# EAGLE design core-debug (EAGLE 6.4)
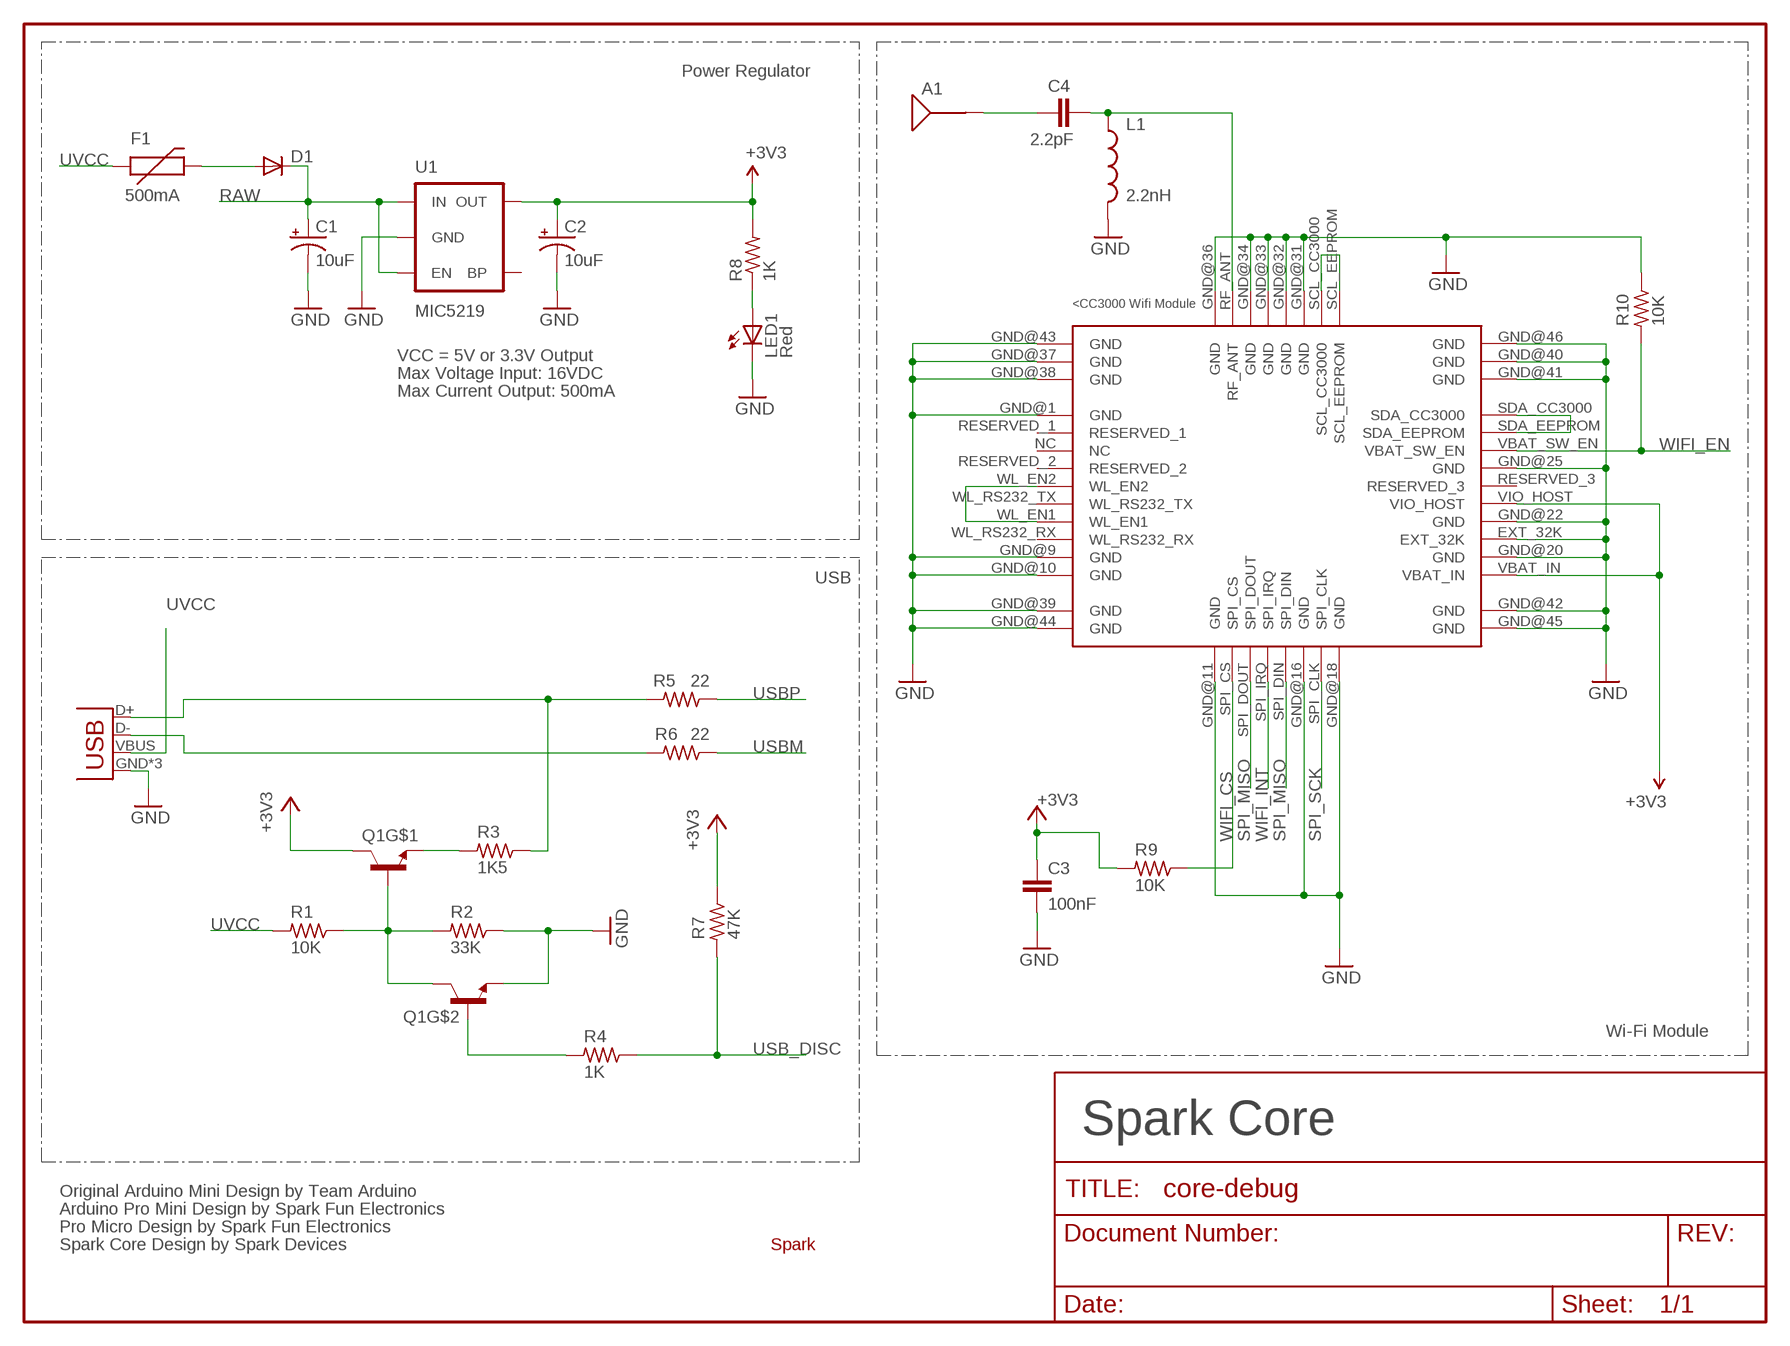
[diagram p0: schematic, sheet 1, part 1 of 2]
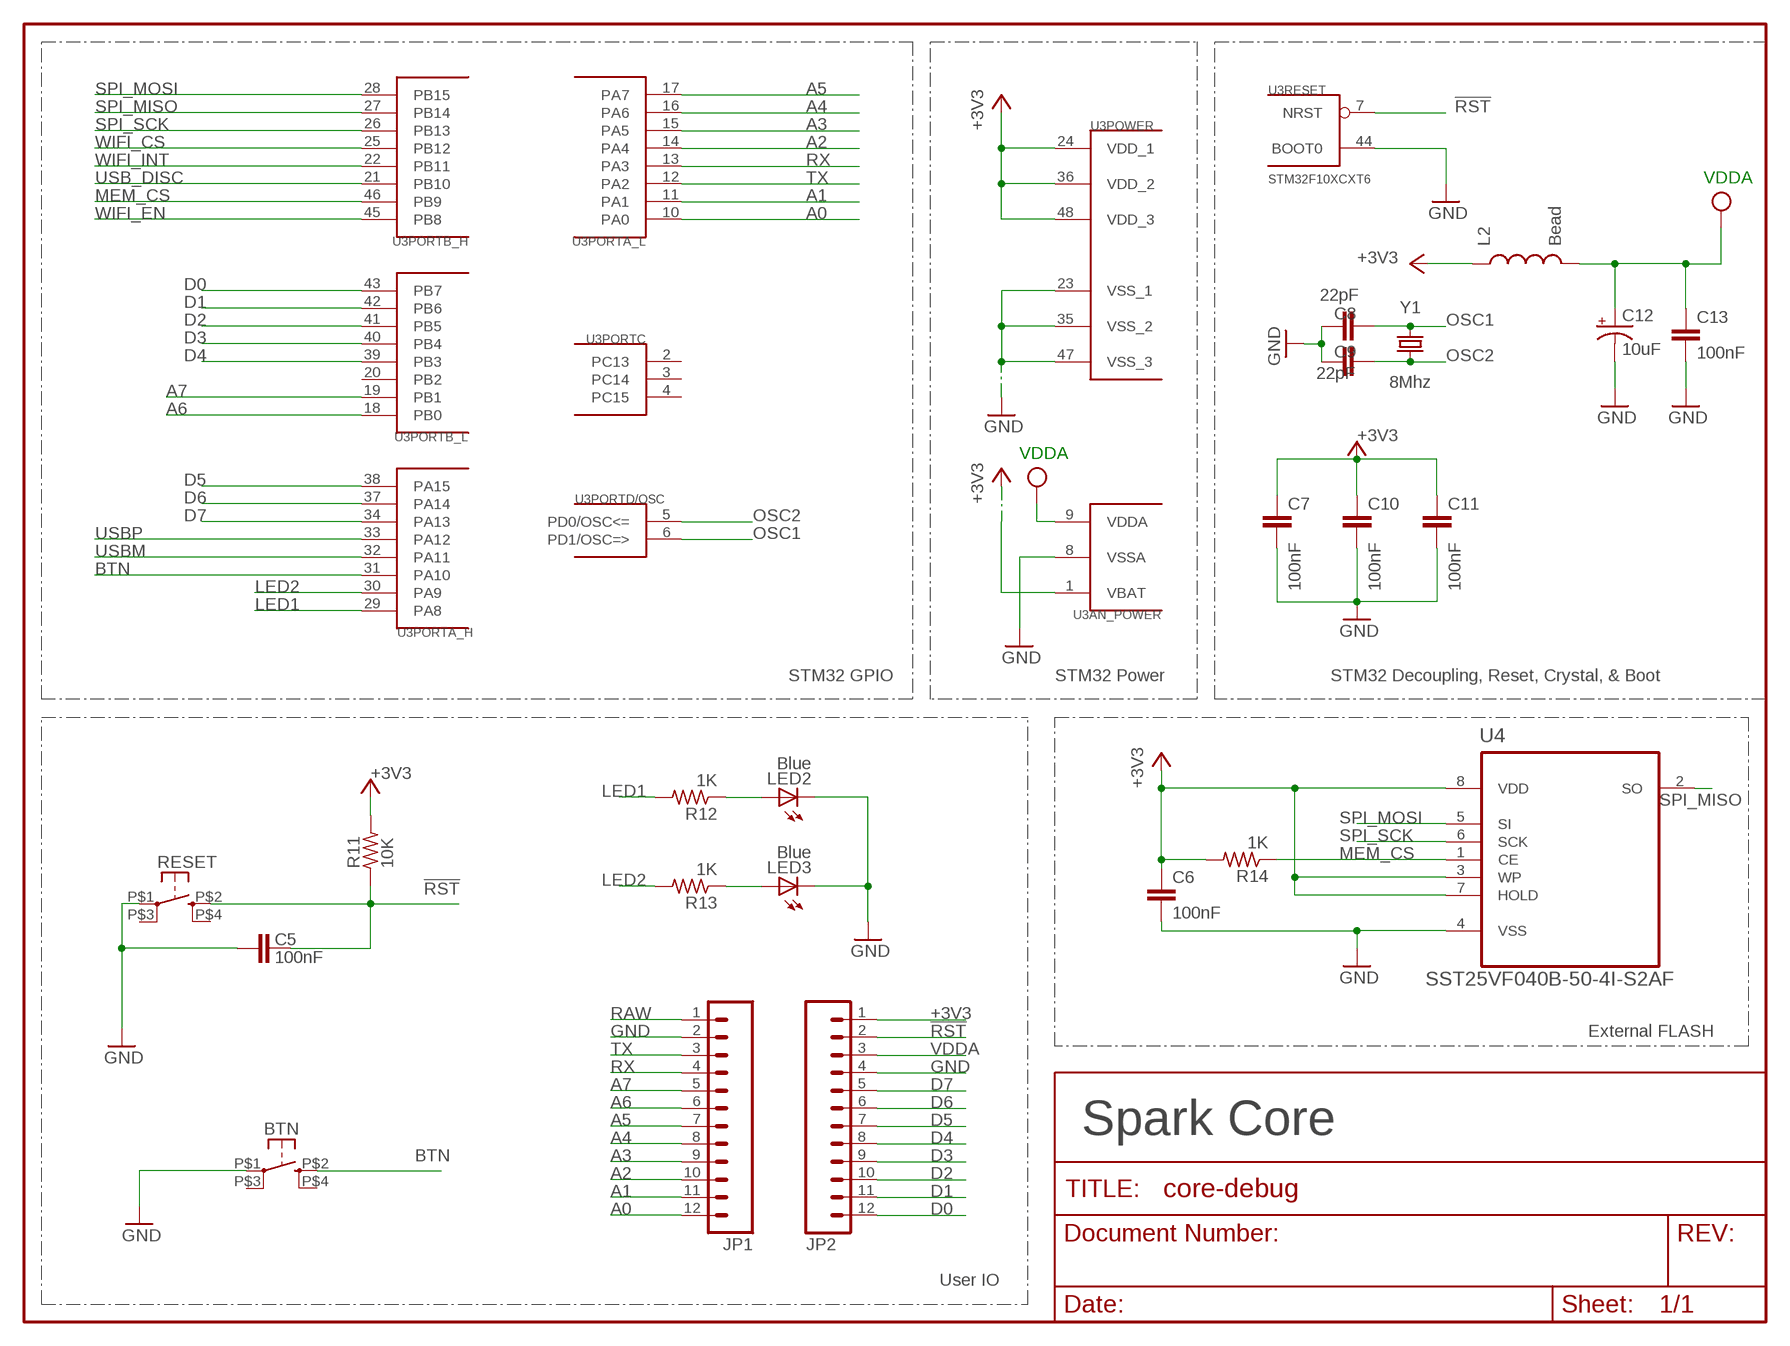
[diagram p1: schematic, sheet 1, part 2 of 2]

## Parts
A1  ANTENNA2SMD5  [ANTENNA-CHIP5]
BTN  KMR211GLFS  BUTTON-KMR241GLFS  [PUSHBUTTON-KMR241GLFS]
C1  10uF  CAP_POL1206  [EIA3216]
C2  10uF  CAP_POL1206  [EIA3216]
C3  100nF  C-EUC0603  [C0603]
C4  2.2pF  C-EUC0603  [C0603]
C5  100nF  C-EUC0603  [C0603]
C6  100nF  C-EUC0603  [C0603]
C7  100nF  C-EUC0603  [C0603]
C8  22pF  C-EUC0603  [C0603]
C9  22pF  C-EUC0603  [C0603]
C10  100nF  C-EUC0603  [C0603]
C11  100nF  C-EUC0603  [C0603]
C12  10uF  CAP_POL1206  [EIA3216]
C13  100nF  C-EUC0603  [C0603]
D1  DIODESOD  [SOD-323]
F1  500mA  PTCSMD  [PTC-1206]
JP1  M12PTH  [1X12]
JP2  M12PTH  [1X12]
L1  2.2nH  INDUCTOR0603  [0603]
L2  Bead  INDUCTOR0603  [0603]
LED1  Red  LED0603  [LED-0603]
LED2  Blue  LED0603  [LED-0603]
LED3  Blue  LED0603  [LED-0603]
Q1  MMDT3904  [SOT363]
R1  10K  R-US_R0603  [R0603]
R2  33K  R-US_R0603  [R0603]
R3  1K5  R-US_R0603  [R0603]
R4  1K  R-US_R0603  [R0603]
R5  22  R-US_R0603  [R0603]
R6  22  R-US_R0603  [R0603]
R7  47K  R-US_R0603  [R0603]
R8  1K  R-US_R0603  [R0603]
R9  10K  R-US_R0603  [R0603]
R10  10K  R-US_R0603  [R0603]
R11  10K  R-US_R0603  [R0603]
R12  1K  R-US_R0603  [R0603]
R13  1K  R-US_R0603  [R0603]
R14  1K  R-US_R0603  [R0603]
RESET  KMR211GLFS  BUTTON-KMR241GLFS  [PUSHBUTTON-KMR241GLFS]
U1  MIC5219  V_REG_LDOSMD  [SOT23-5]
U2  CC3000  [CC3000]
U3  STM32F10XCXT6  [TQFP48]
U4  SST25VF040B-50-4I-S2AF  [SOIC127P790X216-8N]
U$1  SPARK_LOGO2  [SPARK_LOGO2]
X1  USB-MICROB  [USB-MICROB]
Y1  8Mhz  CRYSTAL5X3  [CRYSTAL-SMD-5X3]

## Nets
!RST: C5.2 JP2.2 R11.1 RESET.P$2 U3.7(RESET:NRST)
+3V3: C2.A(+) C3.1 C6.1 C7.1 C10.1 C11.1 JP2.1 L2.1 Q1.3(C) R7.1 R8.2 R9.2 R11.2 R14.2 U1.5(OUT) U2.VBAT_IN U2.VIO_HOST U3.1(AN_POWER:VBAT) U3.24(POWER:VDD_1) U3.36(POWER:VDD_2) U3.48(POWER:VDD_3) U4.3(WP) U4.7(HOLD) U4.8(VDD)
A0: JP1.12 U3.10(PORTA_L:PA0)
A1: JP1.11 U3.11(PORTA_L:PA1)
A2: JP1.10 U3.14(PORTA_L:PA4)
A3: JP1.9 U3.15(PORTA_L:PA5)
A4: JP1.8 U3.16(PORTA_L:PA6)
A5: JP1.7 U3.17(PORTA_L:PA7)
A6: JP1.6 U3.18(PORTB_L:PB0)
A7: JP1.5 U3.19(PORTB_L:PB1)
BTN: BTN.P$2 U3.31(PORTA_H:PA10)
D0: JP2.12 U3.43(PORTB_L:PB7)
D1: JP2.11 U3.42(PORTB_L:PB6)
D2: JP2.10 U3.41(PORTB_L:PB5)
D3: JP2.9 U3.40(PORTB_L:PB4)
D4: JP2.8 U3.39(PORTB_L:PB3)
D5: JP2.7 U3.38(PORTA_H:PA15)
D6: JP2.6 U3.37(PORTA_H:PA14)
D7: JP2.5 U3.34(PORTA_H:PA13)
GND [vcc]: BTN.P$1 C1.C(-) C2.C(-) C3.2 C5.1 C6.2 C7.2 C8.2 C9.2 C10.2 C11.2 C12.C(-) C13.2 JP1.2 JP2.4 L1.2 LED1.C LED2.C LED3.C Q1.1(E) R2.1 R10.1 RESET.P$1 U1.2(GND) U2.EXT_32K U2.GND@1(GND) U2.GND@9(GND) U2.GND@10(GND) U2.GND@11(GND) U2.GND@16(GND) U2.GND@18(GND) U2.GND@20(GND) U2.GND@22(GND) U2.GND@25(GND) U2.GND@31(GND) U2.GND@32(GND) U2.GND@33(GND) U2.GND@34(GND) U2.GND@36(GND) U2.GND@37(GND) U2.GND@38(GND) U2.GND@39(GND) U2.GND@40(GND) U2.GND@41(GND) U2.GND@42(GND) U2.GND@43(GND) U2.GND@44(GND) U2.GND@45(GND) U2.GND@46(GND) U3.8(AN_POWER:VSSA) U3.23(POWER:VSS_1) U3.35(POWER:VSS_2) U3.44(RESET:BOOT0) U3.47(POWER:VSS_3) U4.4(VSS) X1.GND X1.MT1(GND) X1.MT2(GND)
LED1: R12.2 U3.29(PORTA_H:PA8)
LED2: R13.2 U3.30(PORTA_H:PA9)
MEM_CS: R14.1 U3.46(PORTB_H:PB9) U4.1(CE)
N$1: R3.1 R5.2 X1.D+
N$2: LED2.A R12.1
N$3: D1.2(A) F1.2
N$4: C4.2 L1.1 U2.RF_ANT
N$5: A1.FEED(SIGNAL) C4.1
N$6: R6.2 X1.D-
N$7: U2.SCL_CC3000 U2.SCL_EEPROM
N$8: Q1.2(B) R4.2
N$9: U2.WL_EN1 U2.WL_EN2
N$10: LED3.A R13.1
N$13: Q1.5(B) Q1.6(C) R1.1 R2.2
N$15: U2.SDA_CC3000 U2.SDA_EEPROM
N$16: Q1.4(E) R3.2
N$38: LED1.A R8.1
OSC1: C8.1 U3.6(PORTD/OSC:PD1/OSC=>) Y1.3
OSC2: C9.1 U3.5(PORTD/OSC:PD0/OSC<=) Y1.1
RAW [vcc]: C1.A(+) D1.1(C) JP1.1 U1.1(IN) U1.3(EN)
RX: JP1.4 U3.13(PORTA_L:PA3)
SPI_MISO: U2.SPI_DIN U2.SPI_DOUT U3.27(PORTB_H:PB14) U4.2(SO)
SPI_MOSI: U3.28(PORTB_H:PB15) U4.5(SI)
SPI_SCK: U2.SPI_CLK U3.26(PORTB_H:PB13) U4.6(SCK)
TX: JP1.3 U3.12(PORTA_L:PA2)
USB_DISC: R4.1 R7.2 U3.21(PORTB_H:PB10)
USBM: R6.1 U3.32(PORTA_H:PA11)
USBP: R5.1 U3.33(PORTA_H:PA12)
UVCC: F1.1 R1.2 X1.VBUS
VDDA: C12.A(+) C13.1 JP2.3 L2.2 U3.9(AN_POWER:VDDA) ; supply symbol labelled VCC
WIFI_CS: R9.1 U2.SPI_CS U3.25(PORTB_H:PB12)
WIFI_EN: R10.2 U2.VBAT_SW_EN U3.45(PORTB_H:PB8)
WIFI_INT: U2.SPI_IRQ U3.22(PORTB_H:PB11)
Unconnected: BTN.P$3 BTN.P$4 RESET.P$3 RESET.P$4 U1.4(BP) U2.NC U2.RESERVED_1 U2.RESERVED_2 U2.RESERVED_3 U2.WL_RS232_RX U2.WL_RS232_TX U3.2(PORTC:PC13) U3.3(PORTC:PC14) U3.4(PORTC:PC15) U3.20(PORTB_L:PB2)

## Notes on the sheet
- Power Regulator
- VDDA
- VCC = 5V or 3.3V Output
- Max Voltage Input: 16VDC
- Max Current Output: 500mA
- VDDA
- USB
- STM32 GPIO | STM32 Power | STM32 Decoupling, Reset, Crystal, & Boot
- Wi-Fi Module | External FLASH
- Spark Core | Spark Core
- Original Arduino Mini Design by Team Arduino
- Arduino Pro Mini Design by Spark Fun Electronics
- Pro Micro Design by Spark Fun Electronics
- Spark Core Design by Spark Devices
- User IO

## Library data of the parts
A1 = SparkFun-RF:ANTENNA2: Chip antenna Single endded antenna. Common with smaller chip antennas. CHIP4 package is the GPS Chip Antenna SKU: GPS-08418. CHIP5 package is 2.4GHz chip antenna SKU: WRL-00144.
BTN RESET = okie:BUTTON-KMR241GLFS
C1 C2 C12 = SparkFun:CAP_POL: Capacitor Polarized These are standard SMD and PTH capacitors. Normally 10uF, 47uF, and 100uF in electrolytic and tantalum varieties. Always verify the external diameter of the through hole cap, it varies with capacity, voltage, and manufacturer. The EIA devices should be standard.
C3-C11 C13 = rcl:C-EU: CAPACITOR, European symbol
D1 = SparkFun:DIODE: Diode These are standard reverse protection diodes and small signal diodes. SMA package can handle up to about 1A. SOD-323 can handle about 200mA. What the SOD-323 package when ordering, there are some mfgs out there that are 5-pin packages.
F1 = SparkFun:PTC: Resettable Fuse PTC Resettable Fuse. Spark Fun Electronics SKU : COM-08357
JP1 JP2 = SparkFun:M12: Header 12 Standard 12-pin 0.1" header. Use with straight break away headers (SKU : PRT-00116), right angle break away headers (PRT-00553), swiss pins (PRT-00743), machine pins (PRT-00117), and female headers (PRT-00115).
L1 L2 = SparkFun-Passives:INDUCTOR: Inductors Basic Inductor/Choke - 0603 and 1206. Footprints are not proven and vary greatly between part numbers.
LED1-LED3 = SparkFun:LED: LEDs Standard schematic elements and footprints for 5mm, 3mm, 1206, and 0603 sized LEDs. 5mm - Spark Fun Electronics SKU : COM-00529 (and others)
Q1 = SparkFun-DiscreteSemi:MMDT3904: Dual NPN transistor
R1-R14 = rcl:R-US_: RESISTOR, American symbol
U1 = SparkFun:V_REG_LDO: Voltage Regulator LDO Standard 150mA LDO voltage regulator in SOT-23 layout. Micrel part MIC5205. BP (by-pass) pin is used to lower output noise with 470pF cap.
U2 = CC3000:CC3000
U3 = stm32:STM32F10XCXT6: ST STM32F101/103 48pin LQFP
U4 = Silicon_Storage_Tech_By_element14_Batch_1:SST25VF040B-50-4I-S2AF: 4 Mbit SPI Serial Flash; MPN: SST25VF040B-50-4I-S2AF; OC_FARNELL: 1368690; OC_NEWARK: -; PACKAGE: SOIC-8; SUPPLIER: SILICON STORAGE TECHNOLOGY
U$1 = Spark:SPARK_LOGO2
X1 = SparkFun-Connectors:USB: USB Connectors USB-B-PTH is fully proven SKU : PRT-00139/CONN-08278 USB-miniB is fully proven SKU : PRT-00587 USB-A-PCB is untested. USB-A-H is throughly reviewed, but untested. Spark Fun Electronics SKU : PRT-00437 USB-B-SMT is throughly reviewed, but untested. Needs silkscreen touching up. USB-A-S has not been used/tested USB-MB-H has not been used/tested USB-MICROB has been used. CONN-09505; PROD_ID: CONN-09505
Y1 = SparkFun:CRYSTAL: Crystals Various standard crystals. Proven footprints. Spark Fun Electronics SKU : COM-00534

## Board
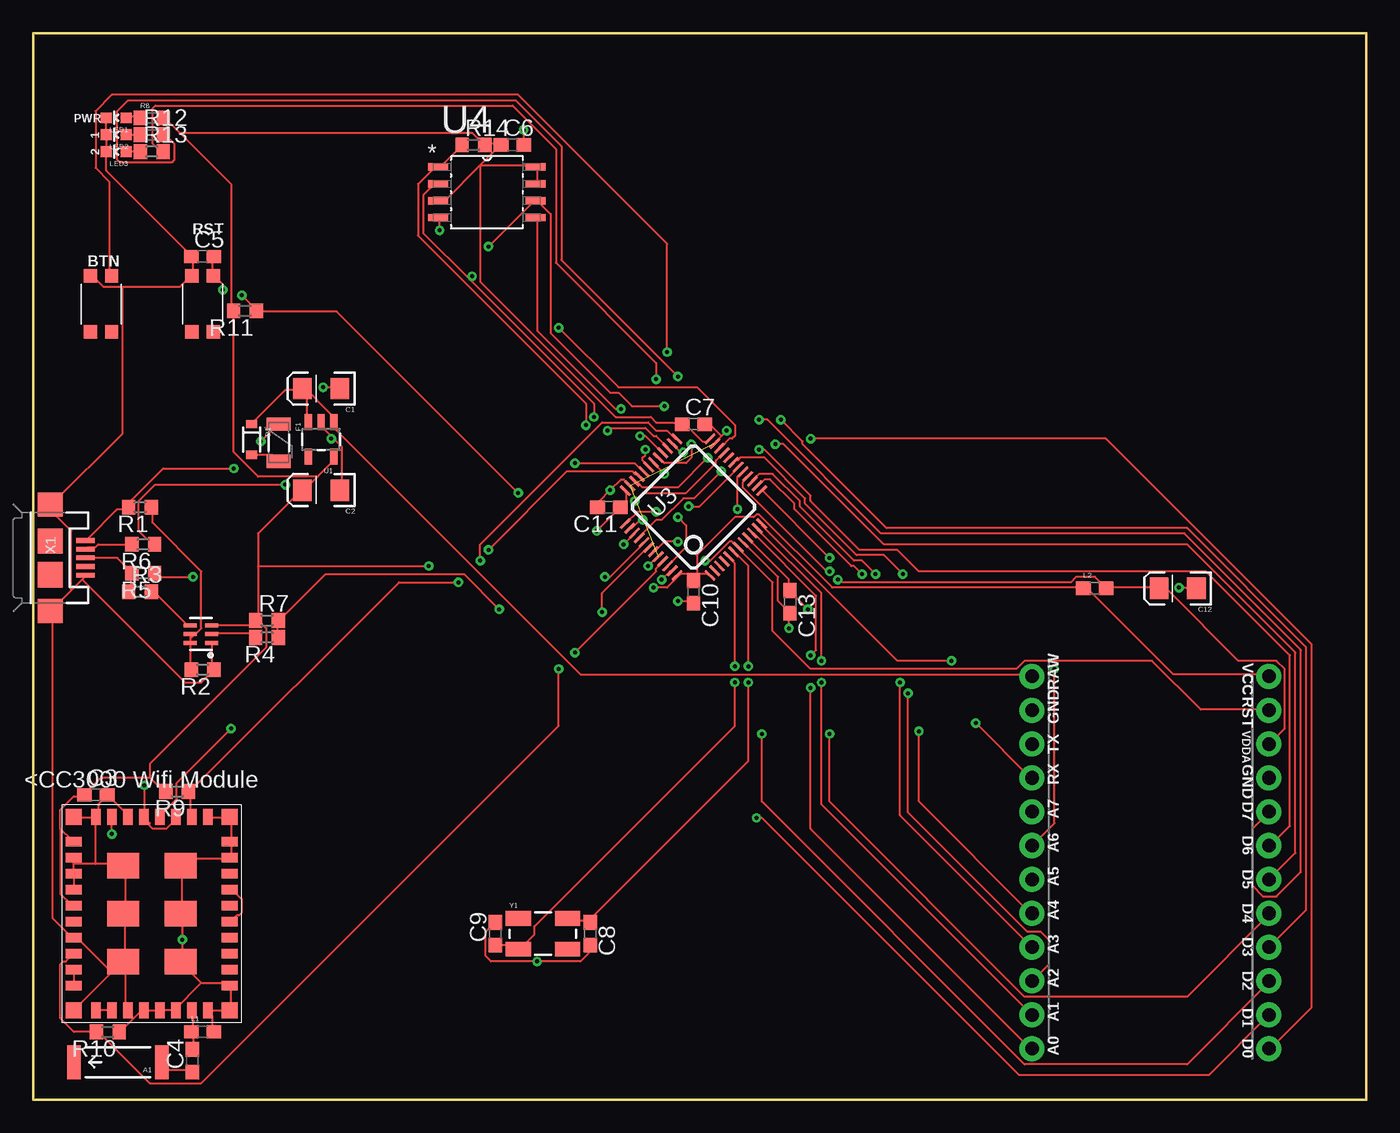
[diagram p2: board, top side]
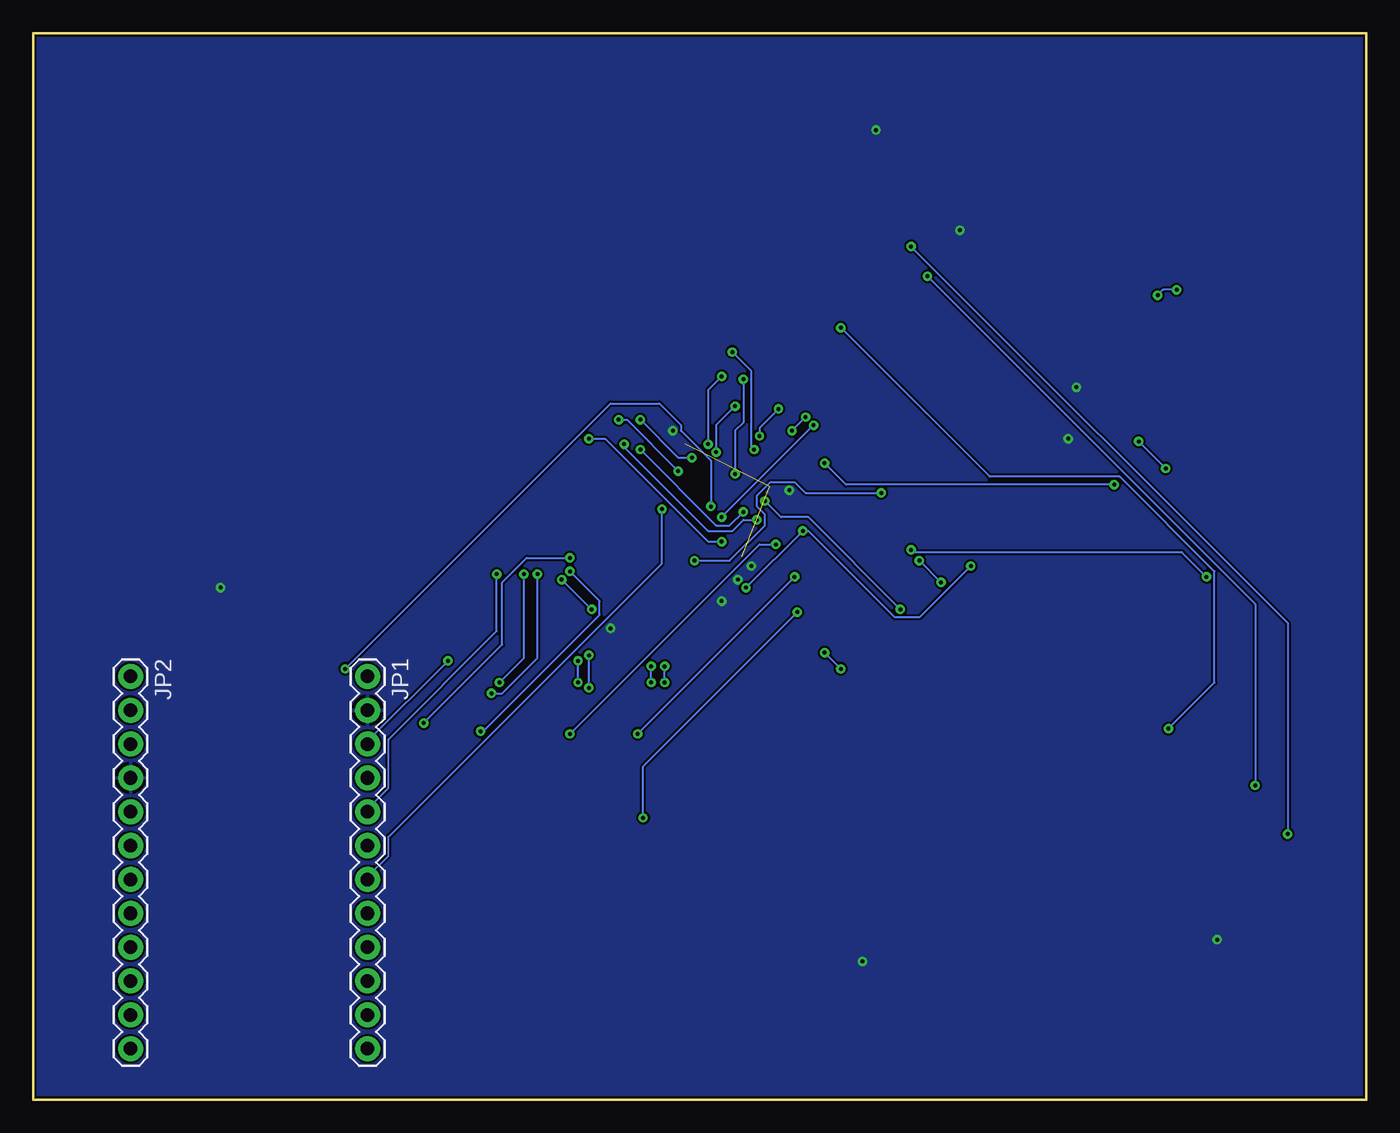
[diagram p3: board, bottom side, seen from below]

Size 100 x 80 mm. Coordinates in mm from the lower left corner, seen from the top.
Outline: 0,80 0,0 100,0 100,80 0,80
Copper layers (1*16): Top 0.035mm / dielectric 1.5mm / Bottom 0.035mm
Design rules "default *": minimum track width 6mil, minimum drill 0.3mm, track to track 6mil, track to pad 6mil, pad to pad 6mil, via to via 6mil, smd to smd 6mil, copper to edge 6mil, drill to drill 6mil, minimum pad ring 12mil, minimum via ring 8mil, stop-mask expansion 4mil, vias tented up to drill 20mil, thermal gap 10mil

### Footprints (pad centres in the part's own frame; a part is rotated, then mirrored left to right if it is on the bottom)
ANTENNA-CHIP5 = smd 1.016 x 2.54: FEED -3.302,0; NC 3.302,0
PUSHBUTTON-KMR241GLFS = smd 1 x 1: P$1 2.1,0.8; P$2 2.1,-0.8; P$3 -2.1,0.8; P$4 -2.1,-0.8
EIA3216 = smd 1.4 x 1.6: A 1.4,0; C -1.4,0
C0603 = smd 1.1 x 1: 1 -0.85,0; 2 0.85,0
SOD-323 = smd 0.63 x 0.83: 1 -1.15,0; 2 1.15,0
PTC-1206 = smd 1 x 1.8: 1 -1.4,0; 2 1.4,0
1X12 = drill 1.016 pad 1.88: 1 0,0; 2 2.54,0; 3 5.08,0; 4 7.62,0; 5 10.16,0; 6 12.7,0; 7 15.24,0; 8 17.78,0; 9 20.32,0; 10 22.86,0; 11 25.4,0; 12 27.94,0
0603 = smd 1.1 x 1: 1 -0.85,0; 2 0.85,0
LED-0603 = smd 0.8 x 0.8: A 0,-0.75; C 0,0.75
SOT363 = smd 0.3 x 0.99: 1 -0.65,-0.8; 2 0,-0.8; 3 0.65,-0.8; 4 0.65,0.81; 5 0,0.81; 6 -0.65,0.81
R0603 = smd 1 x 1.1: 1 -0.85,0; 2 0.85,0
SOT23-5 = smd 0.55 x 1.2: 1 -0.95,-1.3; 2 0,-1.3; 3 0.95,-1.3; 4 0.95,1.3; 5 -0.95,1.3
CC3000 = smd 1.2 x 0.7: EXT_32K 5.85,-2.97; GND@1 -5.85,5.43; GND@9 -5.85,-4.17; GND@10 -5.85,-5.37; GND@20 5.85,-4.17; GND@22 5.85,-1.77; GND@25 5.85,1.83; NC -5.85,3.03; RESERVED_1 -5.85,4.23; RESERVED_2 -5.85,1.83; RESERVED_3 5.85,0.63; SDA_CC3000 5.85,5.43; SDA_EEPROM 5.85,4.23; VBAT_IN 5.85,-5.37; VBAT_SW_EN 5.85,3.03; VIO_HOST 5.85,-0.57; WL_EN1 -5.85,-1.77; WL_EN2 -5.85,0.63; WL_RS232_RX -5.85,-2.97; WL_RS232_TX -5.85,-0.57 | smd 0.7 x 1.2: GND@11 -4.2,-7.22; GND@16 1.8,-7.22; GND@18 4.2,-7.22; GND@31 1.8,7.28; GND@32 0.6,7.28; GND@33 -0.6,7.28; GND@34 -1.8,7.28; GND@36 -4.2,7.28; RF_ANT -3,7.28; SCL_CC3000 3,7.28; SCL_EEPROM 4.2,7.28; SPI_CLK 3,-7.22; SPI_CS -3,-7.22; SPI_DIN 0.6,-7.22; SPI_DOUT -1.8,-7.22; SPI_IRQ -0.6,-7.22 | smd 2.4 x 1.9: GND@37 -2.15,3.63; GND@38 -2.15,0.03; GND@39 -2.15,-3.57; GND@40 2.15,3.63; GND@41 2.15,0.03; GND@42 2.15,-3.57 | smd 1.2 x 1.2: GND@43 -5.85,7.28; GND@44 -5.85,-7.22; GND@45 5.85,-7.22; GND@46 5.85,7.28
TQFP48 = smd 0.2 x 1: 1 -2.75,-4.5; 2 -2.25,-4.5; 3 -1.75,-4.5; 4 -1.25,-4.5; 5 -0.75,-4.5; 6 -0.25,-4.5; 7 0.25,-4.5; 8 0.75,-4.5; 9 1.25,-4.5; 10 1.75,-4.5; 11 2.25,-4.5; 12 2.75,-4.5; 25 2.75,4.5; 26 2.25,4.5; 27 1.75,4.5; 28 1.25,4.5; 29 0.75,4.5; 30 0.25,4.5; 31 -0.25,4.5; 32 -0.75,4.5; 33 -1.25,4.5; 34 -1.75,4.5; 35 -2.25,4.5; 36 -2.75,4.5 | smd 1 x 0.2: 13 4.5,-2.75; 14 4.5,-2.25; 15 4.5,-1.75; 16 4.5,-1.25; 17 4.5,-0.75; 18 4.5,-0.25; 19 4.5,0.25; 20 4.5,0.75; 21 4.5,1.25; 22 4.5,1.75; 23 4.5,2.25; 24 4.5,2.75; 37 -4.5,2.75; 38 -4.5,2.25; 39 -4.5,1.75; 40 -4.5,1.25; 41 -4.5,0.75; 42 -4.5,0.25; 43 -4.5,-0.25; 44 -4.5,-0.75; 45 -4.5,-1.25; 46 -4.5,-1.75; 47 -4.5,-2.25; 48 -4.5,-2.75
SOIC127P790X216-8N = smd 1.499 x 0.559: 1 -3.658,1.905; 2 -3.658,0.635; 3 -3.658,-0.635; 4 -3.658,-1.905; 5 3.658,-1.905; 6 3.658,-0.635; 7 3.658,0.635; 8 3.658,1.905
USB-MICROB = smd 0.35 x 1.4: D+ 0,2.65; D- -0.65,2.65; GND 1.3,2.65; ID 0.65,2.65; VBUS -1.3,2.65 | smd 1.8 x 1.9: MT1 -4,0; MT2 4,0 | smd 1.9 x 1.9: P$1 -1.27,0; P$2 1.27,0
CRYSTAL-SMD-5X3 = smd 1.9 x 1.1: 1 -1.85,-1.15; 2 1.85,-1.15; 3 1.85,1.15; 4 -1.85,1.15

### Placement (x,y rotation side)
A1  6.35,2.79 180 top
BTN  5.08,59.69 90 top
C1  21.59,53.34 180 top
C2  21.59,45.72 180 top
C3  4.7,22.86 0 top
C4  11.94,2.92 90 top
C5  12.7,63.25 0 top
C6  35.94,71.63 0 top
C7  49.53,50.67 0 top
C8  41.78,12.45 270 top
C9  34.67,12.45 90 top
C10  49.53,38.1 270 top
C11  43.18,44.45 180 top
C12  85.85,38.35 180 top
C13  56.77,37.34 270 top
D1  16.38,49.53 270 top
F1  18.41,49.28 270 top
JP1  74.93,31.75 270 bottom
JP2  92.71,31.75 270 bottom
L1  12.7,5.08 0 top
L2  79.63,38.35 0 top
LED1  6.22,73.66 90 top
LED2  6.22,72.39 90 top
LED3  6.22,71.12 90 top
Q1  12.57,34.92 90 top
R1  8,44.45 180 top
R2  12.7,32.26 180 top
R3  8,38.1 0 top
R4  17.53,34.67 180 top
R5  8.26,39.5 180 top
R6  8.26,41.66 180 top
R7  17.53,35.94 0 top
R8  8.89,73.66 0 top
R9  10.79,23.11 180 top
R10  5.59,5.08 180 top
R11  15.88,59.18 180 top
R12  8.89,72.39 0 top
R13  8.89,71.12 0 top
R14  33.02,71.63 0 top
RESET  12.7,59.69 90 top
U1  21.59,49.53 180 top
U2  8.89,13.97 180 top
U3  49.53,44.45 45 top
U4  34.04,68.07 0 top
U$1  91.44,33.02 0 top
X1  1.27,40.64 270 top
Y1  38.23,12.45 0 top

### Tracks (layer width: path | path; a pad name or v marks a point on that pad's centre or on a via)
!RST  (via drill 0.3)
  Top 0.152: C5.2 13.41,63.2 13.41,61.98 RESET.P$2 13.61,61.77 14.22,61.16 v14.22,60.76 | v15.65,60.35 16.66,59.33 R11.1 16.87,59.13 22.76,59.13 v36.37,45.52 | JP2.2 92.66,29.26 87.58,29.26 83.92,32.92 74.37,32.92 73.76,32.31 58.32,32.31 55.47,35.15 55.47,38.81 53.03,41.25 U3.7 52.83,41.45 52.43,41.86 52.22,41.86 50.8,40.44 v50.39,40.44
  Bottom 0.152: v15.65,60.35 15.24,60.76 v14.22,60.76 | v36.37,45.52 42.06,45.52 42.88,46.33 44.7,46.33 45.72,45.31 45.72,44.5 45.11,43.89 45.11,43.08 47.75,40.44 v50.39,40.44
+3V3  (via drill 0.3)
  Top 0.152: U3.36 44.5,45.52 44.5,44.91 44.09,44.5 C11.1 43.89,44.3 v42.27,42.67 | 49.78,39.42 50.6,39.42 U3.1 | 49.78,39.42 49.58,39.42 | 49.58,39.42 48.56,39.42 | 48.56,39.42 48.36,39.42 U3.48 | 49.58,39.42 49.58,39.01 C10.1 49.78,39.42 | v46.53,38.41 47.55,38.41 48.56,39.42 | JP2.1 92.66,31.9 85.55,31.9 79.25,38.2 78.84,38.2 L2.1 78.64,38.41 59.94,38.41 54.46,43.89 54.25,43.89 54.05,43.69 52.63,43.69 49.78,40.84 49.78,39.42 | U3.24 50.6,49.38 50.19,49.38 48.77,50.8 C7.1 48.56,50.8 46.74,50.8 46.33,51.21 43.69,51.21 33.53,61.37 33.53,70.1 | U4.7 37.8,68.89 37.8,69.9 U4.8 37.59,70.1 33.53,70.1 | 33.53,70.1 34.95,71.53 C6.1 34.95,71.73 33.93,71.73 R14.2 33.73,71.73 32.92,72.54 10.97,72.54 | 33.53,70.1 30.89,67.46 30.48,67.46 U4.3 | 10.97,72.54 9.75,73.76 R8.2 | 10.97,72.54 14.83,68.68 14.83,59.33 R11.2 15.04,59.13 15.04,48.56 16.87,46.74 21.34,46.74 | 2.03,20.32 2.03,21.74 3.05,22.76 3.66,22.76 C3.1 3.86,22.96 5.08,24.18 8.74,24.18 | 2.03,20.32 2.85,19.51 U2.VBAT_IN | 8.74,24.18 9.75,23.16 R9.2 | 2.03,20.32 2.03,15.44 2.85,14.63 U2.VIO_HOST | Q1.3 13.41,35.56 16.46,35.56 16.66,35.76 R7.1 16.87,35.97 | 21.34,46.74 20.32,45.72 C2.A 20.12,45.72 16.87,42.47 16.87,40.03 | 21.34,46.74 22.35,47.75 22.35,48.16 U1.5 | 16.87,40.03 16.87,35.97 | 8.74,24.18 8.74,25.2 17.48,33.93 17.48,35.36 16.87,35.97 | 16.87,40.03 v29.67,40.03
  Bottom 0.152: v46.53,38.41 v42.27,42.67 41.86,42.67 35.36,36.17 33.53,36.17 v29.67,40.03
A0  (via drill 0.3)
  Top 0.152: v58.32,33.33 58.73,33.73 58.73,37.8 54.05,42.47 U3.10 | v58.32,30.89 58.32,20.32 74.78,3.86 JP1.12
  Bottom 0.152: v58.32,30.89 v58.32,33.33
A1  (via drill 0.3)
  Top 0.152: v59.13,32.92 59.13,38 54.46,42.67 U3.11 | v59.13,31.29 59.13,22.15 JP1.11
  Bottom 0.152: v59.13,31.29 v59.13,32.92
A2  (via drill 0.3)
  Top 0.152: v62.18,39.42 61.57,40.03 61.37,40.03 57.1,44.3 57.1,44.7 55.27,46.53 54.86,46.53 54.46,46.13 U3.14 | v65.63,30.48 65.63,21.54 74.57,12.6 75.59,12.6 76.2,11.99 76.2,10.16 JP1.10
  Bottom 0.152: v62.18,39.42 62.18,33.12 64.82,30.48 v65.63,30.48
A3  (via drill 0.3)
  Top 0.152: v63.2,39.42 62.18,40.44 61.57,40.44 57.51,44.5 57.51,44.91 55.47,46.94 54.46,46.94 54.05,46.53 U3.15 | v65.02,31.29 65.02,21.34 JP1.9
  Bottom 0.152: v63.2,39.42 63.2,33.12 v65.02,31.29
A4  (via drill 0.3)
  Top 0.152: v59.74,39.62 59.54,39.62 53.24,45.92 53.24,46.33 53.65,46.74 U3.16 | v66.45,27.64 66.45,22.35 74.78,14.02 JP1.8
  Bottom 0.152: v59.74,39.62 57.51,37.39 57.51,36.37 66.24,27.64 v66.45,27.64
A5  (via drill 0.3)
  Top 0.152: v52.83,44.3 52.83,46.74 53.24,47.14 U3.17
  Bottom 0.152: v52.83,44.3 52.83,40.23 73.36,19.71 73.36,18.29 74.98,16.66 JP1.7
A6  (via drill 0.3)
  Top 0.152: v49.17,44.5 49.99,44.5 52.83,47.35 U3.18 | v76.61,32.31 76.61,20.73 JP1.6
  Bottom 0.152: v49.17,44.5 49.17,47.95 51.41,50.19 51.41,50.6 53.03,52.22 56.69,52.22 v76.61,32.31
A7  (via drill 0.3)
  Top 0.152: v65.23,39.42 63.8,40.84 61.77,40.84 57.91,44.7 57.91,45.11 54.86,48.16 53.03,48.16 52.83,47.95 52.63,47.95 U3.19
  Bottom 0.152: v65.23,39.42 65.23,35.15 73.36,27.03 73.36,23.37 74.98,21.74 JP1.5
BTN  (via drill 0.3)
  Top 0.152: v47.55,56.08 47.55,64.21 36.37,75.39 5.89,75.39 4.67,74.17 4.67,69.9 5.69,68.89 5.69,61.98 BTN.P$2 | v45.92,48.77 45.92,48.36 45.72,48.16 45.72,47.95 46.13,47.55 U3.31
  Bottom 0.152: v47.55,56.08 46.13,54.66 46.13,48.97 v45.92,48.77
D0  (via drill 0.3)
  Top 0.152: v48.36,41.86 47.35,41.86 46.53,41.05 U3.43 | v58.32,49.58 80.47,49.58 95.91,34.14 95.91,6.91 92.86,3.86 JP2.12
  Bottom 0.152: v48.36,41.86 49.38,41.86 57.1,49.58 v58.32,49.58
D1  (via drill 0.3)
  Top 0.152: v42.67,36.58 42.67,38 46.13,41.45 U3.42 | v54.25,21.13 54.66,21.13 73.97,1.83 88.19,1.83 JP2.11
  Bottom 0.152: v42.67,36.58 54.25,24.99 v54.25,21.13
D2  (via drill 0.3)
  Top 0.152: v42.88,39.22 43.28,39.22 45.72,41.66 U3.41 | v54.66,27.43 54.66,22.35 74.37,2.64 86.56,2.64 92.66,8.74 JP2.10
  Bottom 0.152: v54.66,27.43 v42.88,39.22
D3  (via drill 0.3)
  Top 0.152: v51.61,47.14 49.58,45.11 48.77,45.11 47.14,43.48 46.74,43.48 45.52,42.27 U3.40 | v56.08,51 57.71,49.38 57.71,49.17 64.01,42.88 86.56,42.88 95.5,33.93 95.5,14.22 JP2.9
  Bottom 0.152: v51.61,47.14 55.47,51 v56.08,51
D4  (via drill 0.3)
  Top 0.152: v44.3,41.66 45.11,42.47 U3.39 | v59.74,27.43 59.74,22.35 74.37,7.72 86.56,7.72 92.66,13.82 JP2.8
  Bottom 0.152: v44.3,41.66 45.52,41.66 v59.74,27.43
D5  (via drill 0.3)
  Top 0.152: v45.72,43.48 45.52,43.48 44.91,42.88 U3.38 | v55.68,49.17 56.29,49.17 63.8,41.66 86.56,41.66 94.69,33.53 94.69,18.49 JP2.7
  Bottom 0.152: v45.72,43.48 46.74,43.48 47.55,42.67 49.38,42.67 55.68,48.97 v55.68,49.17
D6  (via drill 0.3)
  Top 0.152: v46.74,44.09 45.31,44.09 44.5,43.28 U3.37 | v54.46,48.77 54.86,48.77 58.32,45.31 58.32,44.91 61.98,41.25 64.82,41.25 66.45,39.62 87.99,39.62 94.28,33.33 94.28,20.52 92.86,19.1 JP2.6
  Bottom 0.152: v46.74,44.09 47.75,43.08 48.77,43.08 v54.46,48.77
D7  (via drill 0.3)
  Top 0.152: v50.6,48.16 48.36,45.92 45.72,45.92 45.31,46.33 U3.34 | v54.46,51 55.07,51 63.6,42.47 86.36,42.47 95.1,33.73 95.1,17.07 93.27,15.24 92.25,15.24 91.44,16.05 91.44,20.32 JP2.5
  Bottom 0.152: v50.6,48.16 51.61,48.16 v54.46,51
GND  (via drill 0.3)  (2 unrouted)
  Top 0.152: L1.2 13.41,5.08 13.41,6.3 13.21,6.5 U2.GND@36 13.21,6.71 14.63,6.71 U2.GND@43 14.83,6.71 14.83,8.53 U2.GND@1 14.63,8.74 12.6,8.74 | U2.GND@11 13.21,21.13 14.63,21.13 U2.GND@44 14.83,21.13 14.83,19.51 U2.GND@10 14.83,19.3 14.83,18.29 U2.GND@9 14.63,18.09 11.58,18.09 11.18,17.68 U2.GND@39 11.18,17.48 11.18,14.02 U2.GND@38 11.18,13.82 v11.18,11.99 11.18,10.36 U2.GND@37 11.18,10.16 12.6,8.74 | 4.67,21.13 3.05,21.13 U2.GND@45 | U2.GND@16 7.11,21.34 5.69,22.76 C3.2 5.49,22.76 4.88,22.15 4.88,21.34 U2.GND@18 4.67,21.13 | U2.GND@22 3.05,15.85 3.05,16.87 U2.EXT_32K 3.05,17.07 3.05,17.68 | 3.05,17.68 3.05,18.09 U2.GND@20 | 4.67,17.68 6.71,17.68 U2.GND@42 6.91,17.48 6.91,14.02 U2.GND@41 6.91,13.82 6.91,10.36 U2.GND@40 | 4.67,17.68 3.05,17.68 | 4.67,17.68 4.67,21.13 | 10.57,6.71 9.55,6.71 U2.GND@33 9.35,6.71 8.33,6.71 U2.GND@32 8.13,6.71 7.52,6.1 | 7.52,6.1 6.5,5.08 R10.1 | 7.52,6.1 7.11,6.5 U2.GND@31 6.91,6.71 6.91,10.16 U2.GND@40 | 5.89,9.55 6.71,10.36 U2.GND@40 | 5.89,9.55 3.05,6.71 U2.GND@46 | 5.89,9.55 3.45,11.99 3.05,11.99 U2.GND@25 2.85,12.19 1.42,13.61 1.42,36.58 X1.MT2 1.42,36.78 2.85,38.2 | 5.89,9.55 U2.GND@40 | 10.57,6.71 12.6,8.74 | 10.57,6.71 U2.GND@34 | 5.49,71.12 5.49,72.34 LED2.C 5.49,72.54 5.49,73.56 LED1.C | 6.71,60.96 10.97,60.96 11.79,61.77 RESET.P$1 11.99,61.98 11.99,63.2 C5.1 11.79,63.4 5.49,69.7 5.49,71.12 | 6.71,60.96 5.28,60.96 4.47,61.77 BTN.P$1 | 5.49,71.12 LED3.C | Q1.1 13.41,34.14 13.41,32.31 R2.1 13.41,32.11 12.6,31.29 11.38,31.29 3.66,39.01 | 2.85,38.2 3.66,39.01 | 3.66,39.01 3.86,39.22 X1.GND | 2.85,38.2 2.85,42.67 1.42,44.09 1.42,44.5 X1.MT1 1.42,44.7 6.71,49.99 6.71,60.96
  Top 0.152: C9.2 34.54,13.21 33.93,12.6 33.93,10.77 34.34,10.36 v37.8,10.36 41.05,10.36 41.66,10.97 41.66,11.58 C8.2 | U3.8 53.44,41.66 55.88,39.22 55.88,37.39 56.69,36.58 C13.2 56.69,36.37 v56.69,35.36 | 22.35,49.78 23.16,48.97 23.16,45.72 C2.C | 22.35,49.78 21.74,50.39 21.74,50.8 U1.2 | U3.35 44.7,46.13 44.3,46.53 44.09,46.53 v43.28,45.72 42.47,44.91 42.47,44.5 C11.2 | 51.61,49.78 51.21,49.38 U3.23 | 51.61,49.78 50.8,50.6 50.39,50.6 C7.2 | v46.13,40.03 46.74,40.64 U3.44 | v47.14,39.01 47.75,39.62 U3.47 | v48.36,37.39 49.38,37.39 C10.2 | v36.78,72.75 36.78,71.73 C6.2 | v30.48,65.23 30.48,66.04 U4.4 | v21.74,53.44 22.96,53.44 C1.C | v85.95,38.41 87.17,38.41 C12.C | v52.02,50.19 51.61,49.78 | v22.35,49.58 22.35,49.78
  pour Bottom: 0,80.01 0,0 100.33,0 100.33,80.01
LED1  (via drill 0.3)
  Top 0.152: v49.38,49.17 49.38,48.16 48.97,47.75 47.35,47.75 46.94,48.16 U3.29 | v48.36,54.25 39.62,62.99 39.62,71.53 36.17,74.98 7.11,74.98 6.3,74.17 6.3,70.51 6.5,70.31 10.36,70.31 10.57,70.51 10.57,71.73 9.75,72.54 R12.2
  Bottom 0.152: v49.38,49.17 49.38,53.24 v48.36,54.25
LED2  (via drill 0.3)
  Top 0.152: v47.35,46.94 46.53,47.75 U3.30 | v46.74,54.05 46.74,55.27 39.22,62.79 39.22,71.32 35.97,74.57 9.14,74.57 8.94,74.37 8.94,71.73 9.55,71.12 R13.2
  Bottom 0.152: v47.35,46.94 47.35,50.19 46.74,50.8 v46.74,54.05
MEM_CS  (via drill 0.3)
  Top 0.152: v48.36,43.69 48.97,43.08 48.97,41.45 47.75,40.23 U3.46 | v41.45,50.6 41.45,52.22 28.85,64.82 28.85,68.68 30.28,70.1 U4.1 30.48,69.9 32.11,71.53 R14.1
  Bottom 0.152: v41.45,50.6 v48.36,43.69
N$1
  Top 0.152: R3.1 7.32,38.2 7.32,39.42 R5.2 7.32,39.62 6.3,40.64 X1.D+
N$2
  Top 0.152: LED2.A 7.11,72.34 7.92,72.34 R12.1
N$3
  Top 0.152: D1.2 16.46,48.36 17.88,48.36 18.29,47.95 F1.2
N$4
  Top 0.152: 11.99,5.08 11.99,3.86 C4.2 | 11.99,5.08 11.99,6.5 U2.RF_ANT | 11.99,5.08 L1.1
N$5
  Top 0.152: C4.1 11.79,2.23 10.16,2.23 9.75,2.64 A1.FEED
N$6
  Top 0.152: R6.2 4.88,41.66 4.67,41.45 4.06,41.45 X1.D-
N$7
  Top 0.152: U2.SCL_EEPROM 4.88,6.71 5.69,6.71 U2.SCL_CC3000
N$8
  Top 0.152: Q1.2 13.41,34.95 16.46,34.95 16.66,34.75 R4.2
N$9
  Top 0.152: U2.WL_EN2 14.83,13.41 15.24,13.82 15.44,13.82 15.65,14.02 15.65,15.04 14.83,15.85 U2.WL_EN1
N$10
  Top 0.152: R13.1 LED3.A
N$13
  Top 0.152: 11.79,34.54 11.79,34.95 Q1.5 | 11.79,34.54 11.79,34.34 Q1.6 11.79,34.14 11.79,32.31 R2.2 | 11.79,34.54 12.6,35.36 12.6,39.62 8.94,43.28 8.94,44.3 R1.1
N$15
  Top 0.152: U2.SDA_CC3000 3.05,8.74 3.05,9.55 U2.SDA_EEPROM
N$16
  Top 0.152: Q1.4 11.58,35.56 8.94,38.2 R3.2
N$38
  Top 0.152: LED1.A 7.11,73.76 7.92,73.76 R8.1
OSC1  (via drill 0.3)
  Top 0.152: v53.65,32.51 53.65,40.03 52.63,41.05 U3.6 | v53.65,31.29 53.65,25.4 41.66,13.41 | 41.66,13.41 40.23,13.41 Y1.3 | 41.66,13.41 C8.1
  Bottom 0.152: v53.65,31.29 v53.65,32.51
OSC2  (via drill 0.3)
  Top 0.152: v52.63,32.51 52.63,40.23 52.22,40.64 U3.5 | v52.63,31.29 52.63,28.04 37.59,13.01 37.59,12.39 36.78,11.58 | 36.78,11.58 36.58,11.38 Y1.1 36.78,11.58 | 36.78,11.58 34.75,11.58 C9.1
  Bottom 0.152: v52.63,31.29 v52.63,32.51
RAW
  Top 0.152: D1.1 16.46,50.8 18.9,53.24 20.12,53.24 C1.A | U1.3 20.52,51 20.52,53.03 20.32,53.24 C1.A | C1.A 20.32,53.44 22.35,51.41 22.35,51 U1.1 22.55,50.8 22.55,50.39 41.05,31.9 74.78,31.9 JP1.1
RX  (via drill 0.3)
  Top 0.152: v59.74,40.64 54.66,45.72 U3.13 | v70.71,28.25 74.78,24.18 JP1.4
  Bottom 0.152: v59.74,40.64 62.99,40.64 64.82,38.81 64.82,34.14 v70.71,28.25
SPI_MISO  (via drill 0.3)
  Top 0.152: U2.SPI_DOUT 10.77,21.13 9.96,20.32 8.94,20.32 8.74,20.52 8.74,20.73 8.33,21.13 U2.SPI_DIN 8.33,21.34 v8.33,23.57 | v43.08,50.19 43.28,50.39 45.92,50.39 46.53,49.78 46.74,49.78 47.55,48.97 U3.27 | v42.06,51.21 42.06,52.22 32.72,61.57 | 32.72,61.57 29.26,65.02 29.26,67.87 30.28,68.89 U4.2 | 32.72,61.57 v32.92,61.77
  Bottom 0.152: v42.06,51.21 v43.08,50.19 | v8.33,23.57 8.33,37.19 v32.92,61.77
SPI_MOSI  (via drill 0.3)
  Top 0.152: v45.52,49.78 45.92,49.78 47.14,48.56 U3.28 | v44.09,51.82 43.69,51.82 37.8,57.71 37.8,66.04 U4.5
  Bottom 0.152: v45.52,49.78 45.52,50.39 v44.09,51.82
SPI_SCK  (via drill 0.3)
  Top 0.152: v48.77,48.56 48.56,48.56 47.95,49.17 U3.26 | v47.35,52.02 44.91,52.02 43.89,53.03 43.28,53.03 38.81,57.51 38.81,66.45 37.8,67.46 U4.6 37.59,67.46 v34.14,64.01 | v5.89,19.91 5.89,21.13 U2.SPI_CLK
  Bottom 0.152: v48.77,48.56 48.77,50.6 v47.35,52.02 | v5.89,19.91 5.89,35.76 v34.14,64.01
TX  (via drill 0.3)
  Top 0.152: v68.89,32.92 64.82,32.92 54.66,43.08 U3.12
  Bottom 0.152: v68.89,32.92 74.98,26.82 JP1.3
USB_DISC  (via drill 0.3)
  Top 0.152: v45.11,44.91 45.72,45.52 48.97,45.52 51.21,47.75 51.21,47.95 51.82,48.56 U3.21 | v34.95,36.78 32.31,39.42 21.95,39.42 18.49,35.97 R7.2 18.29,35.76 18.29,34.75 R4.1
  Bottom 0.152: v45.11,44.91 43.89,43.69 41.86,43.69 v34.95,36.78
USBM  (via drill 0.3)
  Top 0.152: v40.64,47.75 45.11,47.75 45.72,47.14 U3.32 | v18.9,46.13 9.14,46.13 7.92,44.91 7.92,42.67 8.94,41.66 R6.1
  Bottom 0.152: v40.64,47.75 39.01,46.13 v18.9,46.13
USBP  (via drill 0.3)
  Top 0.152: v34.14,41.25 40.03,47.14 44.91,47.14 45.11,46.94 45.31,46.94 U3.33 | v11.99,39.22 9.35,39.22 9.14,39.42 R5.1
  Bottom 0.152: v34.14,41.25 33.93,41.05 13.82,41.05 v11.99,39.22
UVCC  (via drill 0.3)
  Top 0.152: 6.71,44.3 6.3,44.3 4.06,42.06 X1.VBUS | 6.71,44.3 7.11,44.3 R1.2 6.71,44.3 | v17.07,49.38 18.29,50.6 F1.1 | v15.04,47.35 9.75,47.35 6.71,44.3
  Bottom 0.152: v15.04,47.35 v17.07,49.38
VDDA  (via drill 0.3)
  Top 0.152: U3.9 53.65,42.06 56.69,39.01 56.69,38.2 C13.1 56.9,38 v58.12,36.78 | JP2.3 93.88,27.84 93.88,32.31 93.27,32.92 90.42,32.92 85.14,38.2 84.53,38.2 C12.A 84.33,38.41 80.67,38.41 L2.2 80.47,38.41 79.65,39.22 78.23,39.22 77.83,38.81 60.76,38.81 60.55,39.01 v60.35,39.01
  Bottom 0.152: v60.35,39.01 v58.12,36.78
WIFI_CS  (via drill 0.3)
  Top 0.152: v33.53,40.44 33.53,41.66 42.67,50.8 46.13,50.8 46.74,50.19 47.55,50.19 48.16,49.58 U3.25 | v31.9,38.81 27.43,38.81 11.79,23.16 R9.1 11.79,22.96 11.79,21.34 U2.SPI_CS
  Bottom 0.152: v31.9,38.81 v33.53,40.44
WIFI_EN  (via drill 0.3)
  Top 0.152: v40.64,33.53 46.74,39.62 46.74,39.83 47.14,40.23 U3.45 | v39.42,32.31 39.42,28.04 12.6,1.22 8.74,1.22 4.88,5.08 R10.2 3.05,5.08 2.03,6.1 2.03,10.16 2.23,10.36 2.44,10.36 2.85,10.77 U2.VBAT_SW_EN
  Bottom 0.152: v39.42,32.31 v40.64,33.53
WIFI_INT  (via drill 0.3)
  Top 0.152: v39.42,57.91 43.89,53.44 49.78,53.44 52.63,50.6 52.63,49.78 52.43,49.58 52.22,49.58 51.61,48.97 U3.22 | v14.83,27.84 10.77,23.77 10.77,22.55 9.55,21.34 U2.SPI_IRQ
  Bottom 0.152: v39.42,57.91 28.25,46.74 18.49,46.74 11.38,39.62 11.38,31.29 v14.83,27.84

### Text on the board
tPlace: PWR | 1 | 2 | RST | BTN | VCC | RAW | RST | GND | VDDA | TX | GND | RX | D7 | A7 | D6 | A6 | D5 | A5 | D4 | A4 | D3 | A3 | D2 | A2 | D1 | A1 | D0 | A0